# EAGLE schematic untitled (EAGLE 7.5.0)
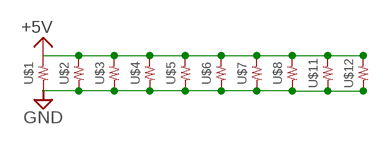
[diagram p0: schematic, sheet 1]

## Parts
U$1  RESISTOR__SMD  [1608]
U$2  RESISTOR__SMD  [1608]
U$3  RESISTOR__SMD  [1608]
U$4  RESISTOR__SMD  [1608]
U$5  RESISTOR__SMD  [1608]
U$6  RESISTOR__SMD  [1608]
U$7  RESISTOR__SMD  [1608]
U$8  RESISTOR__SMD  [1608]
U$11  RESISTOR__SMD  [1608]
U$12  RESISTOR__SMD  [1608]

## Nets
+5V: U$1.2 U$2.2 U$3.2 U$4.2 U$5.2 U$6.2 U$7.2 U$8.2 U$11.2 U$12.2
GND: U$1.1 U$2.1 U$3.1 U$4.1 U$5.1 U$6.1 U$7.1 U$8.1 U$11.1 U$12.1

## Library data of the parts
U$1-U$8 U$11 U$12 = 01_R:RESISTOR__SMD